# Altium schematic sheet LedLampDriver.SchDoc
size A2
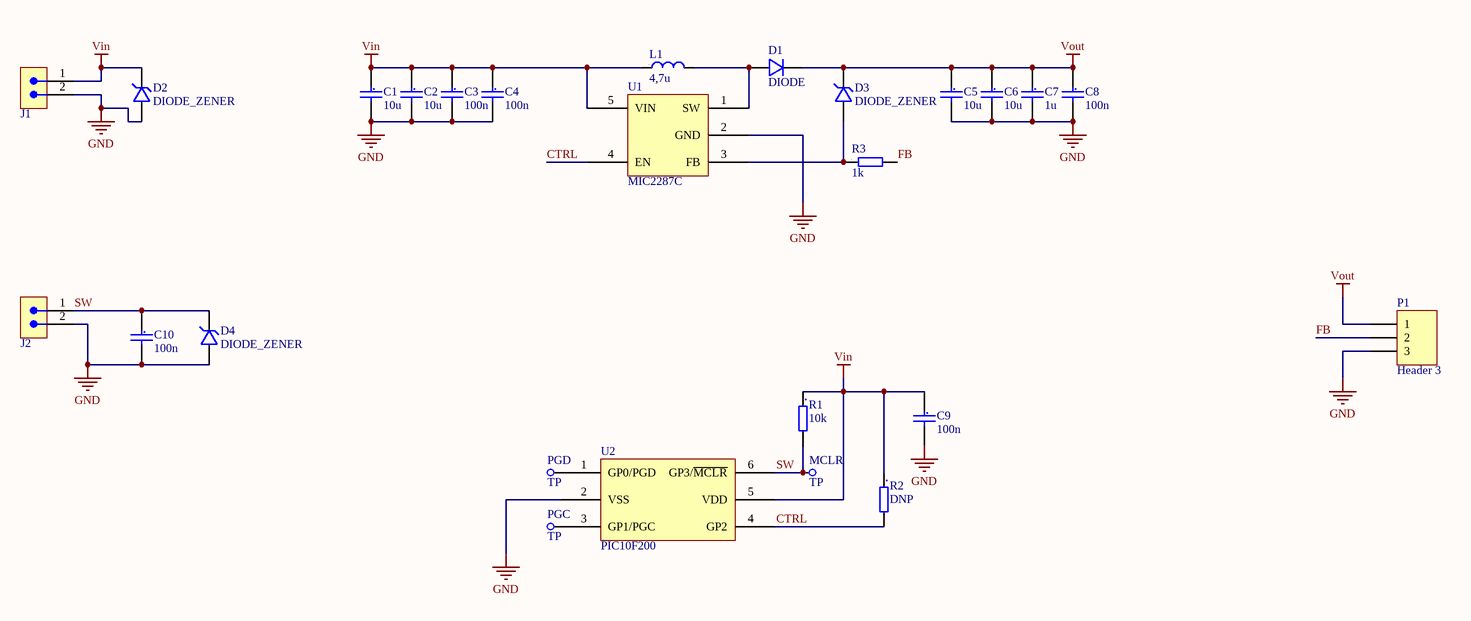
[diagram p0: LedLampDriver.SchDoc]

## Parts
C1  10u  [C0805_N]
C2  10u  [C0603_N]
C3  100n  [C0805_N]
C4  100n  [C0603_N]
C5  10u  [C0805_N]
C6  10u  [C0805_N]
C7  1u  [C0603_N]
C8  100n  [C0603_N]
C9  100n  [C0603_N]
C10  100n  [C0603_N]
D1  DIODE  [SOD-123]
D2  DIODE_ZENER  [SOD-123]
D3  DIODE_ZENER  [SOD-123]
D4  DIODE_ZENER  [SOD-123]
J1  (no value)  [B2B-XH-A]
J2  (no value)  [B2B-XH-A]
L1  4,7u  [IND_2520]
MCLR  TP  [TP_1MM]  (no BOM)
P1  Header 3  [HDR1X3]
PGC  TP  [TP_1MM]  (no BOM)
PGD  TP  [TP_1MM]  (no BOM)
R1  10k  [R0603_N]
R2  DNP  [R0402_N]
R3  1k  [R0402_N]
U1  MIC2287C  [SOT23-5]
U2  PIC10F200  [SOT23-6]

## Nets
GND: C1.2 C2.2 C3.2 C4.2 C5.2 C6.2 C7.2 C8.2 C9.2 C10.2 D2.A D4.A J1.2 J2.2 P1.3 U1.2(GND) U2.2(VSS)
Vin: C1.1 C2.1 C3.1 C4.1 C9.1 D2.C J1.1 L1.1 R1.1 R2.1 U1.5(VIN) U2.5(VDD)
Vout: C5.1 C6.1 C7.1 C8.1 D1.C D3.C P1.1
CTRL: R2.2 U1.4(EN) U2.4(GP2)
FB: P1.2 R3.2
SW: C10.1 D4.C J2.1 MCLR.1 R1.2 U2.6(GP3/~{MCLR})
NetD1_A: D1.A L1.2 U1.1(SW)
NetD3_A: D3.A R3.1 U1.3(FB)
NetPGC_1: PGC.1 U2.3(GP1/PGC)
NetPGD_1: PGD.1 U2.1(GP0/PGD)

## Library data of the parts
C1-C10 = CAP: RevS: $Rev:: 58        $
J1 J2 = PINHDR_2X1: Socket; ComponentLink1Description: Manufacturer; ComponentLink1URL: http://www.we-online.de; ComponentLink2Description: Datasheet; ComponentLink2URL: http://katalog.we-online.de/em/datasheet/691412320002.pdf
L1 = IND: Inductor
P1 = Header 3: Header, 3-Pin; LatestRevisionDate: 17-Jul-2002; LatestRevisionNote: Re-released for DXP Platform.; Publisher: Altium Limited
R1-R3 = RES
U1 = MIC2287C: 1.2MHz PWM White LED Driver with OVP in / 2mm × 2mm MLF™ and Thin SOT-23
U2 = PIC10F200: 6-Pin, 8-Bit Flash MCU